# EAGLE schematic mercedes_shield_v1_5 (EAGLE 5.11)
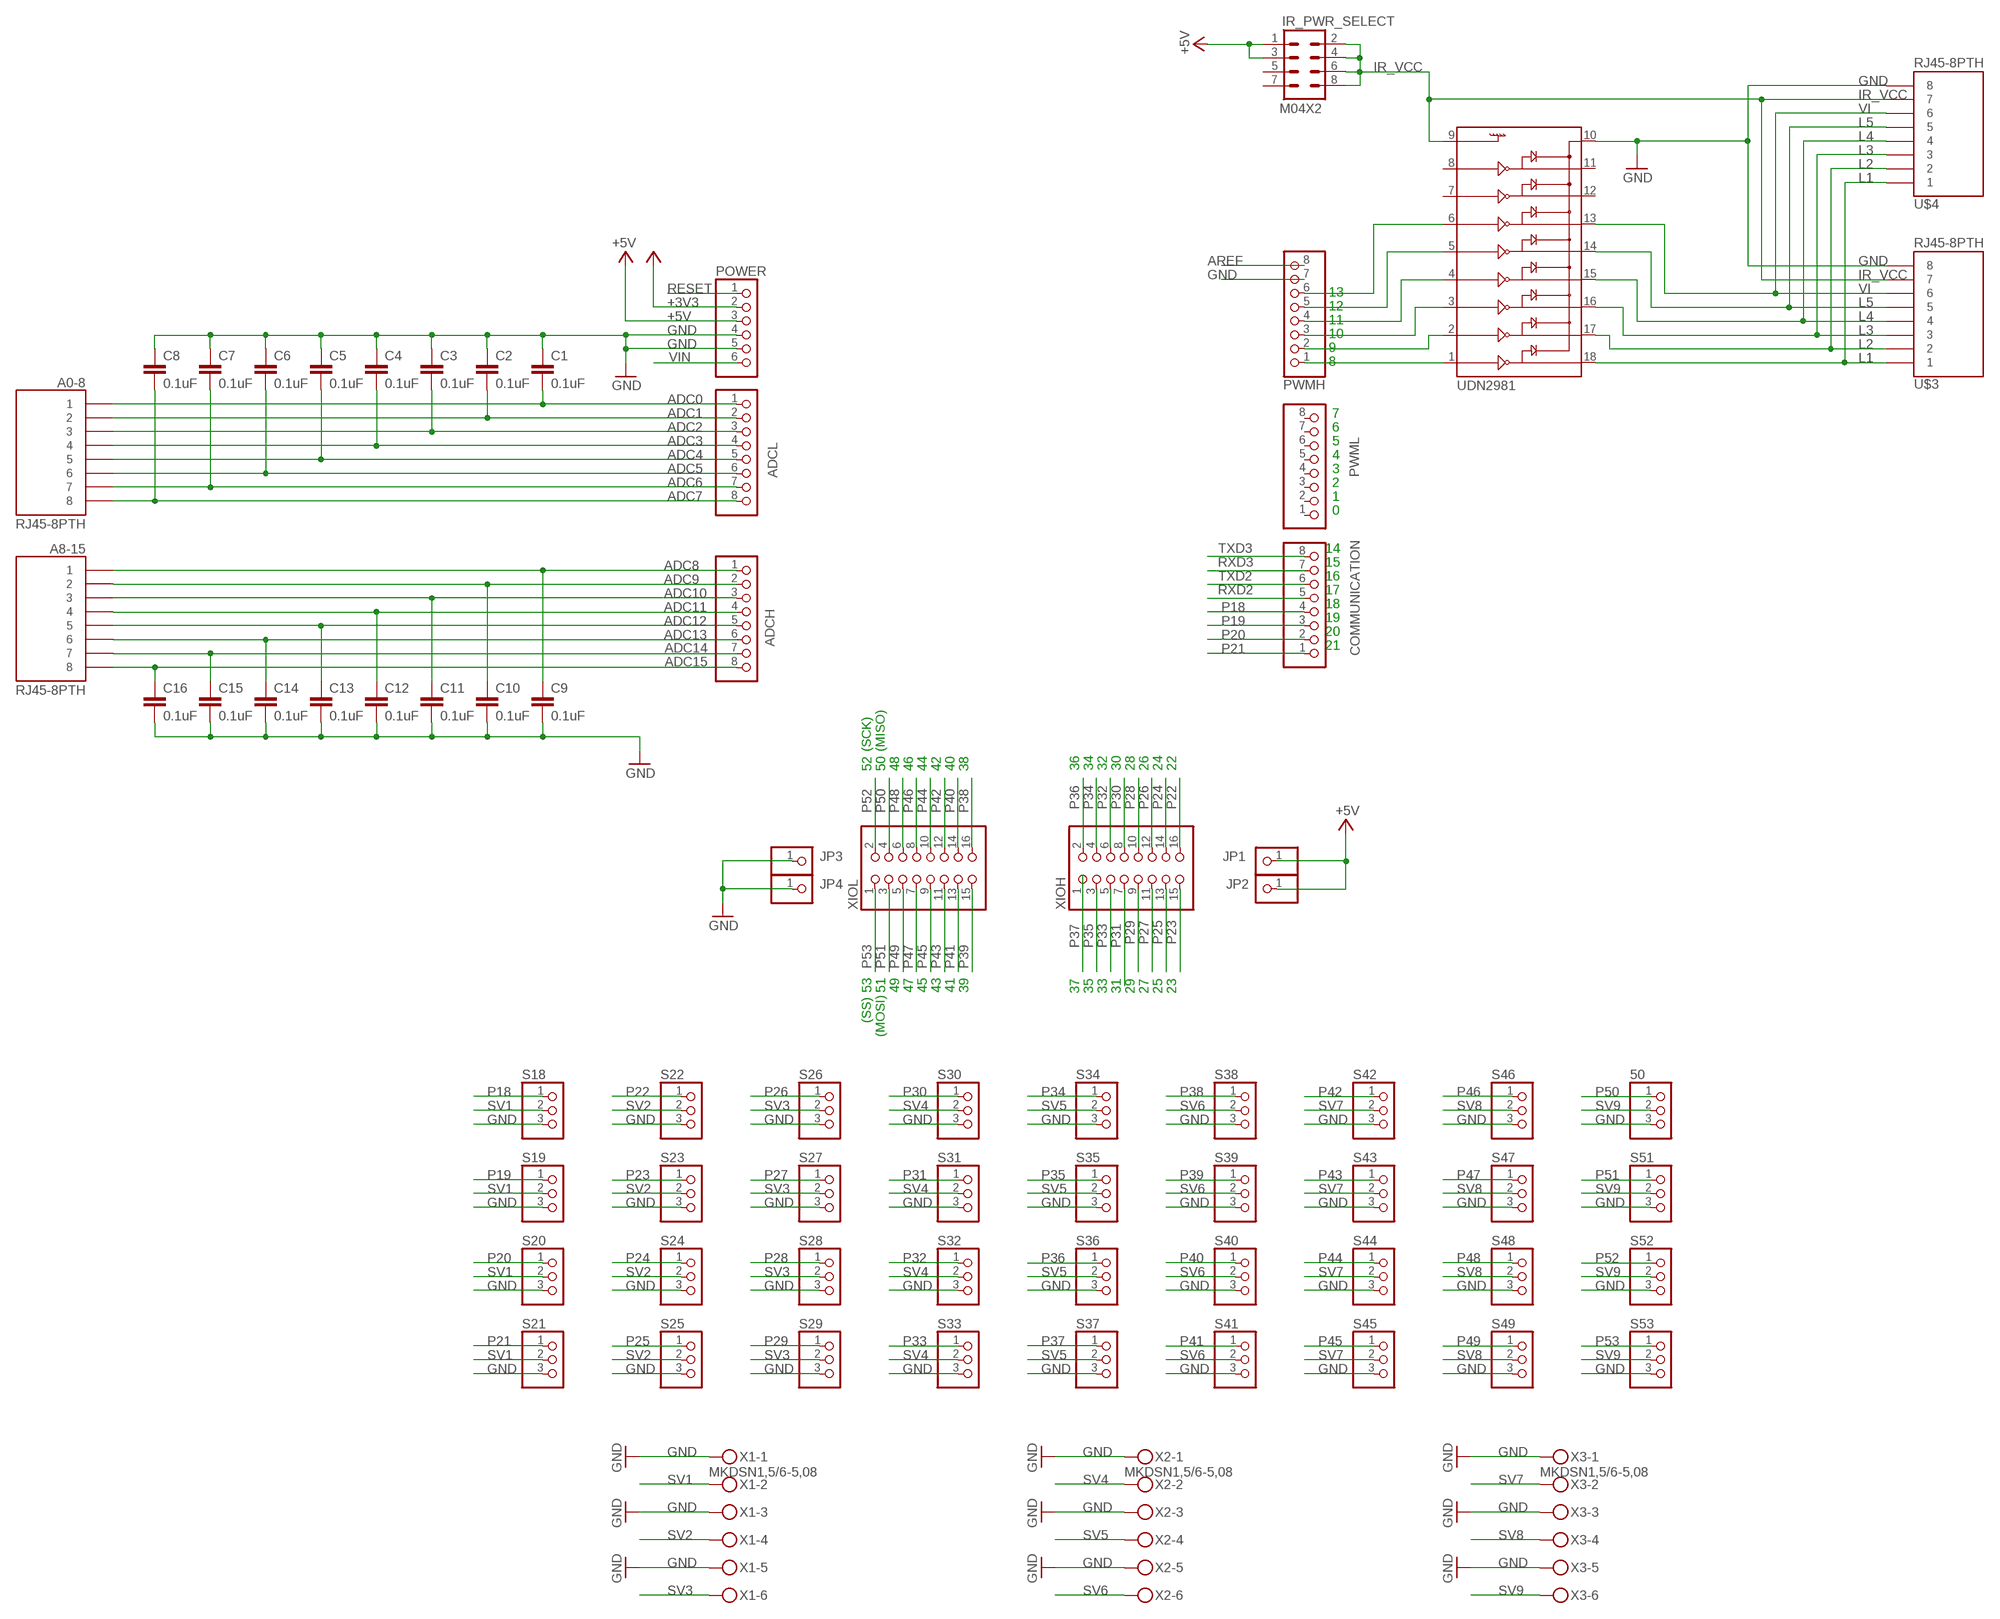
[diagram p0: schematic, sheet 1]

## Parts
50  PINHD-1X3  [1X03]
A0-8  RJ45-8PTH  [RJ45-8]
A8-15  RJ45-8PTH  [RJ45-8]
ADCH  PINHD-1X8  [1X08]
ADCL  PINHD-1X8  [1X08]
C1  0.1uF  CAPPTH  [CAP-PTH-SMALL]
C2  0.1uF  CAPPTH  [CAP-PTH-SMALL]
C3  0.1uF  CAPPTH  [CAP-PTH-SMALL]
C4  0.1uF  CAPPTH  [CAP-PTH-SMALL]
C5  0.1uF  CAPPTH  [CAP-PTH-SMALL]
C6  0.1uF  CAPPTH  [CAP-PTH-SMALL]
C7  0.1uF  CAPPTH  [CAP-PTH-SMALL]
C8  0.1uF  CAPPTH  [CAP-PTH-SMALL]
C9  0.1uF  CAPPTH  [CAP-PTH-SMALL]
C10  0.1uF  CAPPTH  [CAP-PTH-SMALL]
C11  0.1uF  CAPPTH  [CAP-PTH-SMALL]
C12  0.1uF  CAPPTH  [CAP-PTH-SMALL]
C13  0.1uF  CAPPTH  [CAP-PTH-SMALL]
C14  0.1uF  CAPPTH  [CAP-PTH-SMALL]
C15  0.1uF  CAPPTH  [CAP-PTH-SMALL]
C16  0.1uF  CAPPTH  [CAP-PTH-SMALL]
COMMUNICATION  PINHD-1X8  [1X08]
IR_PWR_SELECT  M04X2  [2X4]
JP1  PINHD-1X1  [1X01]
JP2  PINHD-1X1  [1X01]
JP3  PINHD-1X1  [1X01]
JP4  PINHD-1X1  [1X01]
POWER  PINHD-1X6  [1X06]
PWMH  PINHD-1X8  [1X08]
PWML  PINHD-1X8  [1X08]
S18  PINHD-1X3  [1X03]
S19  PINHD-1X3  [1X03]
S20  PINHD-1X3  [1X03]
S21  PINHD-1X3  [1X03]
S22  PINHD-1X3  [1X03]
S23  PINHD-1X3  [1X03]
S24  PINHD-1X3  [1X03]
S25  PINHD-1X3  [1X03]
S26  PINHD-1X3  [1X03]
S27  PINHD-1X3  [1X03]
S28  PINHD-1X3  [1X03]
S29  PINHD-1X3  [1X03]
S30  PINHD-1X3  [1X03]
S31  PINHD-1X3  [1X03]
S32  PINHD-1X3  [1X03]
S33  PINHD-1X3  [1X03]
S34  PINHD-1X3  [1X03]
S35  PINHD-1X3  [1X03]
S36  PINHD-1X3  [1X03]
S37  PINHD-1X3  [1X03]
S38  PINHD-1X3  [1X03]
S39  PINHD-1X3  [1X03]
S40  PINHD-1X3  [1X03]
S41  PINHD-1X3  [1X03]
S42  PINHD-1X3  [1X03]
S43  PINHD-1X3  [1X03]
S44  PINHD-1X3  [1X03]
S45  PINHD-1X3  [1X03]
S46  PINHD-1X3  [1X03]
S47  PINHD-1X3  [1X03]
S48  PINHD-1X3  [1X03]
S49  PINHD-1X3  [1X03]
S51  PINHD-1X3  [1X03]
S52  PINHD-1X3  [1X03]
S53  PINHD-1X3  [1X03]
U$3  RJ45-8PTH  [RJ45-8]
U$4  RJ45-8PTH  [RJ45-8]
UDN2981  ULN2803DIP  [DIL18]
X1  MKDSN1,5/6-5,08  [MKDSN1,5/6-5,08]
X2  MKDSN1,5/6-5,08  [MKDSN1,5/6-5,08]
X3  MKDSN1,5/6-5,08  [MKDSN1,5/6-5,08]
XIOH  PINHD-2X8  [2X08]
XIOL  PINHD-2X8  [2X08]

## Nets
+3V3: POWER.2
+5V: IR_PWR_SELECT.1 IR_PWR_SELECT.3 JP1.1 JP2.1 POWER.3
ADC0: A0-8.1 ADCL.1 C1.2
ADC1: A0-8.2 ADCL.2 C2.2
ADC2: A0-8.3 ADCL.3 C3.2
ADC3: A0-8.4 ADCL.4 C4.2
ADC4: A0-8.5 ADCL.5 C5.2
ADC5: A0-8.6 ADCL.6 C6.2
ADC6: A0-8.7 ADCL.7 C7.2
ADC7: A0-8.8 ADCL.8 C8.2
ADC8: A8-15.1 ADCH.1 C9.1
ADC9: A8-15.2 ADCH.2 C10.1
ADC10: A8-15.3 ADCH.3 C11.1
ADC11: A8-15.4 ADCH.4 C12.1
ADC12: A8-15.5 ADCH.5 C13.1
ADC13: A8-15.6 ADCH.6 C14.1
ADC14: A8-15.7 ADCH.7 C15.1
ADC15: A8-15.8 ADCH.8 C16.1
AREF: PWMH.8
GND: 50.3 C1.1 C2.1 C3.1 C4.1 C5.1 C6.1 C7.1 C8.1 C9.2 C10.2 C11.2 C12.2 C13.2 C14.2 C15.2 C16.2 JP3.1 JP4.1 POWER.4 POWER.5 PWMH.7 S18.3 S19.3 S20.3 S21.3 S22.3 S23.3 S24.3 S25.3 S26.3 S27.3 S28.3 S29.3 S30.3 S31.3 S32.3 S33.3 S34.3 S35.3 S36.3 S37.3 S38.3 S39.3 S40.3 S41.3 S42.3 S43.3 S44.3 S45.3 S46.3 S47.3 S48.3 S49.3 S51.3 S52.3 S53.3 U$3.8 U$4.8 UDN2981.10 X1.1 X1.3 X1.5 X2.1 X2.3 X2.5 X3.1 X3.3 X3.5
IR_VCC: IR_PWR_SELECT.2 IR_PWR_SELECT.4 IR_PWR_SELECT.6 IR_PWR_SELECT.8 U$3.7 U$4.7 UDN2981.9
L1: U$3.1 U$4.1 UDN2981.18
L2: U$3.2 U$4.2 UDN2981.17
L3: U$3.3 U$4.3 UDN2981.16
L4: U$3.4 U$4.4 UDN2981.15
L5: U$3.5 U$4.5 UDN2981.14
N$1: PWMH.1 UDN2981.1
N$2: PWMH.2 UDN2981.2
N$3: PWMH.3 UDN2981.3
N$4: PWMH.4 UDN2981.4
N$5: PWMH.5 UDN2981.5
N$6: PWMH.6 UDN2981.6
P18: COMMUNICATION.4 S18.1
P19: COMMUNICATION.3 S19.1
P20: COMMUNICATION.2 S20.1
P21: COMMUNICATION.1 S21.1
P22: S22.1 XIOH.16
P23: S23.1 XIOH.15
P24: S24.1 XIOH.14
P25: S25.1 XIOH.13
P26: S26.1 XIOH.12
P27: S27.1 XIOH.11
P28: S28.1 XIOH.10
P29: S29.1 XIOH.9
P30: S30.1 XIOH.8
P31: S31.1 XIOH.7
P32: S32.1 XIOH.6
P33: S33.1 XIOH.5
P34: S34.1 XIOH.4
P35: S35.1 XIOH.3
P36: S36.1 XIOH.2
P37: S37.1 XIOH.1
P38: S38.1 XIOL.16
P39: S39.1 XIOL.15
P40: S40.1 XIOL.14
P41: S41.1 XIOL.13
P42: S42.1 XIOL.12
P43: S43.1 XIOL.11
P44: S44.1 XIOL.10
P45: S45.1 XIOL.9
P46: S46.1 XIOL.8
P47: S47.1 XIOL.7
P48: S48.1 XIOL.6
P49: S49.1 XIOL.5
P50: 50.1 XIOL.4
P51: S51.1 XIOL.3
P52: S52.1 XIOL.2
P53: S53.1 XIOL.1
RESET: POWER.1
RXD2: COMMUNICATION.5
RXD3: COMMUNICATION.7
SV1: S18.2 S19.2 S20.2 S21.2 X1.2
SV2: S22.2 S23.2 S24.2 S25.2 X1.4
SV3: S26.2 S27.2 S28.2 S29.2 X1.6
SV4: S30.2 S31.2 S32.2 S33.2 X2.2
SV5: S34.2 S35.2 S36.2 S37.2 X2.4
SV6: S38.2 S39.2 S40.2 S41.2 X2.6
SV7: S42.2 S43.2 S44.2 S45.2 X3.2
SV8: S46.2 S47.2 S48.2 S49.2 X3.4
SV9: 50.2 S51.2 S52.2 S53.2 X3.6
TXD2: COMMUNICATION.6
TXD3: COMMUNICATION.8
VI: U$3.6 U$4.6 UDN2981.13
VIN: POWER.6
Unconnected: IR_PWR_SELECT.5 IR_PWR_SELECT.7 PWML.1 PWML.2 PWML.3 PWML.4 PWML.5 PWML.6 PWML.7 PWML.8 UDN2981.7 UDN2981.8 UDN2981.11 UDN2981.12

## Notes on the sheet
- 13
- 12
- 11
- 10
- 9
- 8
- 7
- 6
- 5
- 4
- 3
- 2
- 1
- 0
- 14
- 15
- 16
- 17
- 18
- 19
- 20
- 21
- (SCK) | (MISO)
- 52 | 50 | 48 | 46 | 44 | 42 | 40 | 38 | 36 | 34 | 32 | 30 | 28 | 26 | 24 | 22
- 53 | 51 | 49 | 47 | 45 | 43 | 41 | 39 | 37 | 35 | 33 | 31 | 29 | 27 | 25 | 23
- (SS)
- (MOSI)

## Library data of the parts
50 S18-S49 S51-S53 = pinhead:PINHD-1X3: PIN HEADER
A0-8 A8-15 U$3 U$4 = SparkFun:RJ45-8: RJ45 Jack Simple RJ45, 8-pin connection - connector for common Cat5, Cat5e, and Cat6 Ethernet cables. Footprint not yet proven in production. Connector sku is PRT-00643; Breakout PCB sku is BOB-00716.
ADCH ADCL COMMUNICATION PWMH PWML = pinhead:PINHD-1X8: PIN HEADER
C1-C16 = SparkFun:CAP: Capacitor Standard 0603 ceramic capacitor, and 0.1" leaded capacitor.
IR_PWR_SELECT = SparkFun:M04X2
JP1-JP4 = pinhead:PINHD-1X1: PIN HEADER
POWER = pinhead:PINHD-1X6: PIN HEADER
UDN2981 = SparkFun:ULN2803: Darlington Driver ULN2803 Darlington array. 500mA max per channel, 8-channel package. Spark Fun Electronics SKU : COM-00312
X1-X3 = con-phoenix-508:MKDSN1,5/6-5,08: MKDSN 1,5/ 6-5,08 Printklemme Nennstrom: 13,5 A Nennspannung: 250 V Rastermaß: 5,08 mm Polzahl: 6 Anschlussart: Schraubanschluss Montage: Löten Anschlussrichtung Leiter/Platine: 0 ° Artikelnummer: 1729160 Source: http://eshop.phoenixcontact.com .. 1729160.pdf; MPN: SMKDSN1,5/6-5,08; OC_FARNELL: 1792907; OC_NEWARK: 70R0302
XIOH XIOL = pinhead:PINHD-2X8: PIN HEADER

## Net classes
0 default: width 0.152 mm, drill 0.305 mm, clearance 0.152 mm